# Altium schematic sheet Power.SchDoc
size A4; SheetNumber: 4; SheetTotal: 11
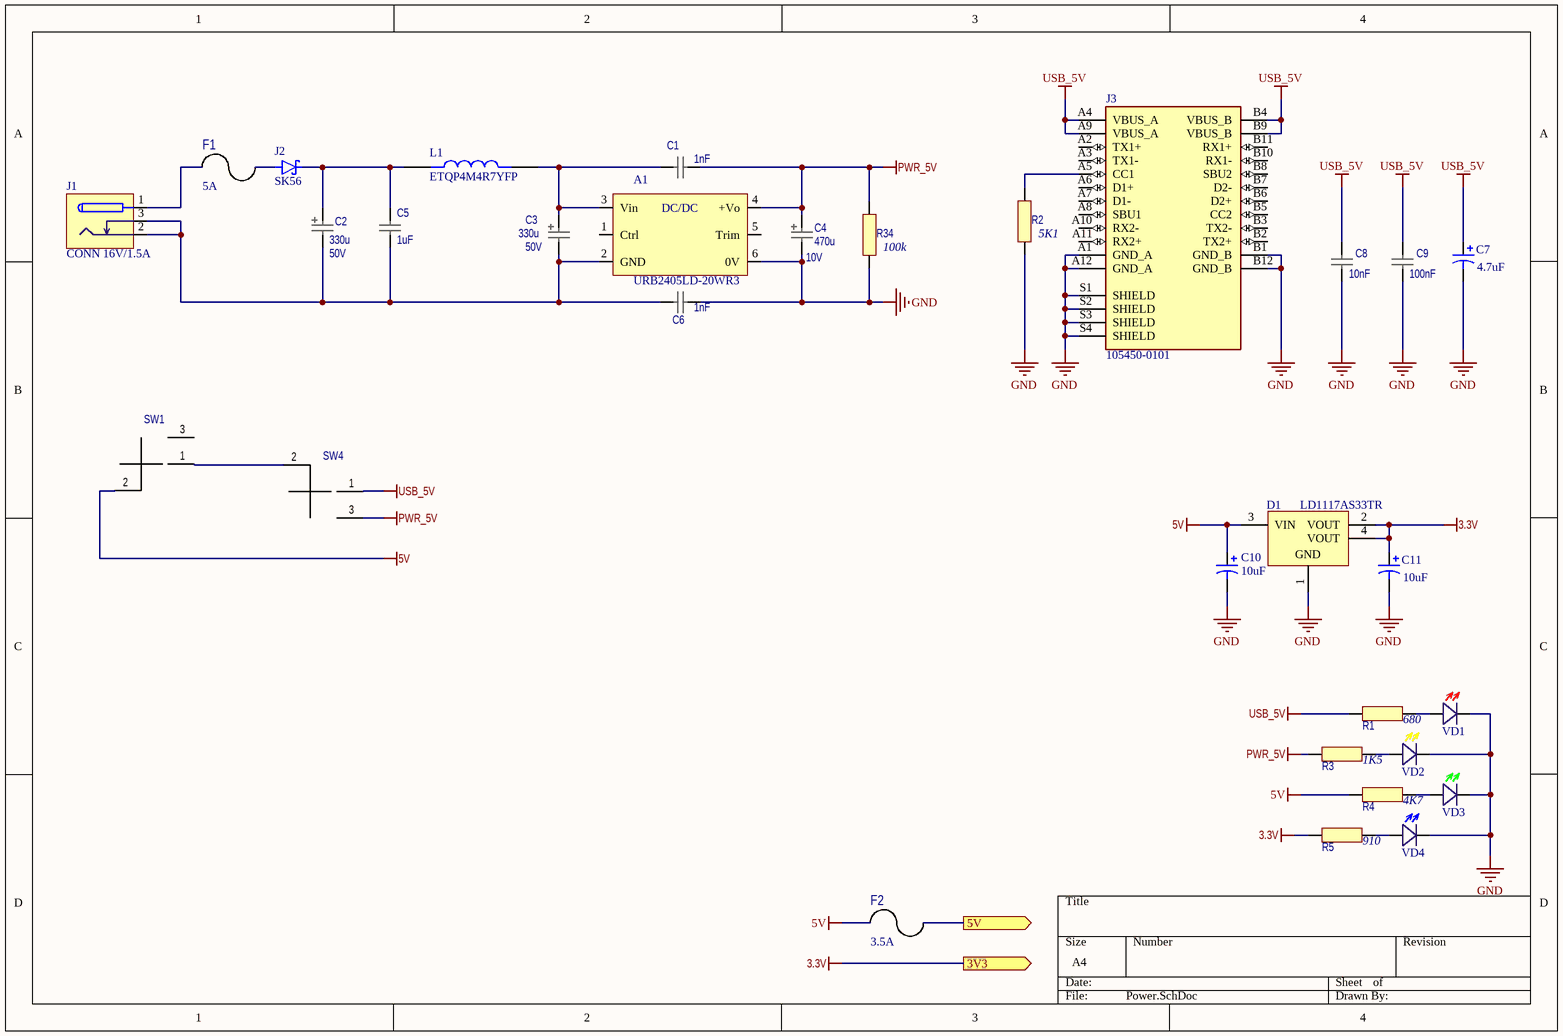
[diagram p0: Power.SchDoc]

## Parts
A1  URB2405LD-20WR3  [URB2405LD-20WR3]
C1  value 1nF  [C0805]  (hidden comment: C0805)
C2  value 330u  Voltage: 50V  [ECAP_10x17]  (hidden comment: C+)
C3  value 330u  Voltage: 50V  [ECAP_10x17]  (hidden comment: C+)
C4  value 470u  Voltage: 10V  [ECAP_8x12]  (hidden comment: C+)
C5  value 1uF  [C0805]  (hidden comment: C0805)
C6  value 1nF  [C0805]  (hidden comment: C0805)
C7  value 4.7uF  [D]  (hidden comment: 194D475X0015D2)
C8  value 10nF  [C0805]  (hidden comment: C0805)
C9  value 100nF  [C0805]  (hidden comment: C0805)
C10  value 10uF  [E]  (hidden comment: 194D106X0015E2)
C11  value 10uF  [3216]  (hidden comment: 293D106X0004A2)
D1  LD1117AS33TR  [SOT-223_N]
F1  5A  [FUSC6127X269N]
F2  3.5A  [FUSC6127X269N]
J1  CONN 16V/1.5A  [DS-261]
J2  SK56  [SMC]
J3  105450-0101  [MOLEX_105450-0101]
L1  ETQP4M4R7YFP  [L]
R1  value 680  [R0805]  (hidden comment: R0805)
R2  value 5K1  [R0805]  (hidden comment: R0805)
R3  value 1K5  [R0805]  (hidden comment: R0805)
R4  value 4K7  [R0805]  (hidden comment: R0805)
R5  value 910  [R0805]  (hidden comment: R0805)
R34  value 100k  [R0805]  (hidden comment: R0805)
SW1  KLS7-SS03-12D02-EG-3.0  [SL19123]  (value not drawn)
SW4  KLS7-SS03-12D02-EG-3.0  [switch]  (value not drawn)
VD1  TO-1608BC-MRE  [TO-1608BC-MRE]  (value not drawn)
VD2  TO-1608BC-MYF  [TO-1608BC-MYF]  (value not drawn)
VD3  TO-1608BC-PG  [TO-1608BC-PG]  (value not drawn)
VD4  TO-1608BC-BF  [TO-1608BC-BF]  (value not drawn)

## Ports
3V3 (out), 5V (out)

## Nets
3.3V: C11.1 D1.2(VOUT) D1.4(VOUT) R5.2 ; port 3V3
5V: C10.1 D1.3(VIN) F2.1 R4.2 SW1.2
GND: A1.6(0V) C4.2 C6.1 C7.2 C8.1 C9.1 C10.2 C11.2 D1.1(GND) J3.A1(GND_A) J3.A12(GND_A) J3.B1(GND_B) J3.B12(GND_B) J3.S1(SHIELD) J3.S2(SHIELD) J3.S3(SHIELD) J3.S4(SHIELD) R2.2 R34.2 VD1.- VD2.- VD3.- VD4.-
PWR_5V: A1.4(+Vo) C1.1 C4.1 R3.2 R34.1 SW4.3
USB_5V: C7.1 C8.2 C9.2 J3.A4(VBUS_A) J3.A9(VBUS_A) J3.B4(VBUS_B) J3.B9(VBUS_B) R1.2 SW4.1
5V: F2.2 ; port 5V  [a separate net that carries the same name]
NetA1_2: A1.2(GND) C2.2 C3.2 C5.1 C6.2 J1.2 J1.3
NetA1_3: A1.3(Vin) C1.2 C3.1 L1.2
NetC2_1: C2.1 C5.2 J2.2(C) L1.1
NetF1_1: F1.1 J1.1
NetF1_2: F1.2 J2.1(A)
NetJ3_A5: J3.A5(CC1) R2.1
NetR1_1: R1.1 VD1.+
NetR3_1: R3.1 VD2.+
NetR4_1: R4.1 VD3.+
NetR5_1: R5.1 VD4.+
NetSW1_1: SW1.1 SW4.2

Not connected (* = marked no-connect by the designer): A1 1(Ctrl) 5(Trim); J3 A2(TX1+) A3(TX1-) A6(D1+) A7(D1-) A8(SBU1) A10(RX2-) A11(RX2+) B2(TX2+) B3(TX2-) B5(CC2) B6(D2+) B7(D2-) B8(SBU2) B10(RX1-) B11(RX1+); SW1 3

## Notes on the sheet
- (in symbol URB2405LD-20WR3) DC/DC

## Library data of the parts
C1 C5 C6 C8 C9 = C0805: Tolerance: %; Voltage: B; Case: *; Dielectric: *; Mount: *; PartNumber: *
C2-C4 = C+: Tolerance: %; Case: *; Dielectric: *; Mount: *; PartNumber: *
C7 = 194D475X0015D2: Midget Conformal Coated Solid Tantalum Chip Capacitor: 4.7uF, 20% Tolerance, 15 WVDC @ +85°C, Surge = 20V; Note: See Data Sheet for full range of components; Published: 19-Mar-2004; PackageReference: D; Publisher: Altium Limited; DatasheetDocument: 05-Jul-2002; ComponentLink1Description: Manufacturer Link; ComponentLink1URL: http://www.vishay.com/; ComponentLink2Description: Datasheet; ComponentLink2URL: http://www.vishay.com/docs/40000/194d.pdf
C10 = 194D106X0015E2: Midget Conformal Coated Solid Tantalum Chip Capacitor: 10uF, 20% Tolerance, 15 WVDC @ +85°C, Surge = 20V; Note: See Data Sheet for full range of components; Published: 19-Mar-2004; DatasheetDocument: 05-Jul-2002; PackageReference: E; Publisher: Altium Limited; ComponentLink1Description: Manufacturer Link; ComponentLink1URL: http://www.vishay.com/; ComponentLink2Description: Datasheet; ComponentLink2URL: http://www.vishay.com/docs/40000/194d.pdf
C11 = 293D106X0004A2: Tantamount Commercial, Surface Mount Solid Tantalum Chip Capacitor: 10uF, 20% Tolerance, 4 WVDC @ +85°C, Surge = 5.2V; Note: See Data Sheet for full range of components; Published: 19-Mar-2004; DatasheetDocument: 05-Feb-2003; PackageReference: 3216; Publisher: Altium Limited; Code_JEITA: 3216; ComponentLink1Description: Manufacturer Link; ComponentLink1URL: http://www.vishay.com/; ComponentLink2Description: Datasheet; ComponentLink2URL: http://www.vishay.com/docs/40002/293d.pdf
D1 = LD1117AS33TR: 1A, Low Drop Positive Voltage Regulator, 3.3V, 4-Pin SOT-223, Tape and Reel; PartNumber: LD1117AS33TR; DatasheetVersion: Dec-2011; PackageVersion: 2010; PackageReference: SOT-223; PackageDescription: 4-Pin SOT-223 Package, 6.5 x 3.5 mm Body, 2.3 mm Pitch, 7 mm Lead Span; ComponentLink1Description: Manufacturer URL; ComponentLink1URL: http://www.st.com; ComponentLink2Description: Datasheet; ComponentLink2URL: http://www.st.com/internet/com/TECHNICAL_RESOURCES/TECHNICAL_LITERATURE/DATASHEET/CD00002116.pdf
F1 F2 = F: 045303.5MR
J1 = DS-261
J2 = SK56: Diode Schottky 60V 5A Surface Mount SMC (DO-214AB); MF: Diotec Semiconductor; SnapEDA_Link: https://www.snapeda.com/parts/SK56/Diotec/view-part/5719358/?ref=snap; Package: DO-214AB-214 Diotec Semiconductor; Check_prices: https://www.snapeda.com/parts/SK56/Diotec/view-part/5719358/?ref=eda; Availability: In Stock; Price: None; MP: SK56; Value: *
L1 = ETQP4M4R7YFP: Power Choke Shielded Wirewound 4.7uH 20% 100KHz Metal 4.8A 39.6mOhm DCR Automotive T/R; MF: Panasonic; Value: *; Price: None; Package: SMD-2 Panasonic; Check_prices: https://www.snapeda.com/parts/ETQP4M4R7YFP/Panasonic/view-part/1533841/?ref=eda; Availability: In Stock; SnapEDA_Link: https://www.snapeda.com/parts/ETQP4M4R7YFP/Panasonic/view-part/1533841/?ref=snap; MP: ETQP4M4R7YFP; Purchase-URL: https://pricing.snapeda.com/search/part/ETQP4M4R7YFP/?ref=eda
SW1 = SL19123 (switch)
SW4 = SW
VD1 = TO-1608BC-MRE: LED SMD 1608 112мКд, 120°, 630нМ (Ultra Bright Red)
VD2 = TO-1608BC-MYF: LED SMD 1608 247мКд, 120°, 592нМ (High Bright Yellow)
VD3 = TO-1608BC-PG: LED SMD 1608 705мКд, 120°, 525нМ (Pure Green)
VD4 = TO-1608BC-BF: LED SMD 1608 247мКд, 120°, 468нМ (Blue)
J3 = 105450-0101: Package: None; Availability: Unavailable; Value: *; MP: 105450-0101; Price: None
R1-R5 R34 = R0805: Case: *; Mount: *; PartNumber: *; Power: *; Tolerance: *